# Altium project 60W20V_BuckConverter.PrjPcb
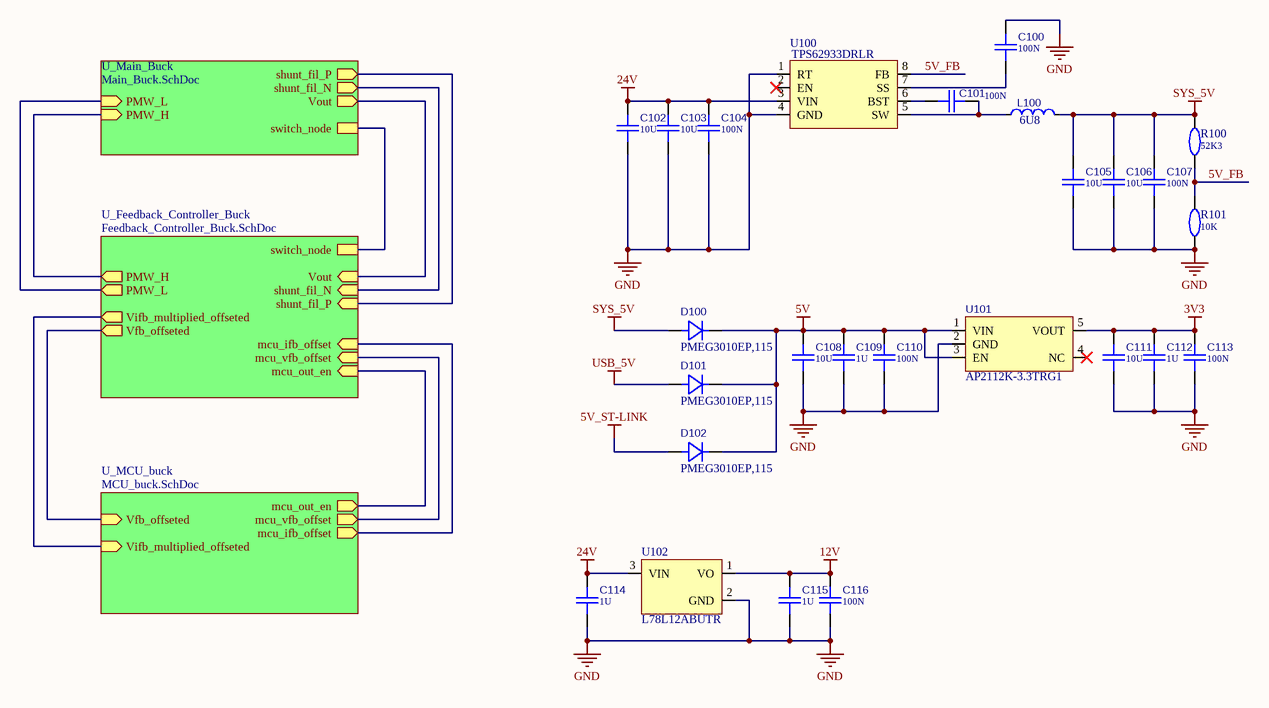
[diagram p0: Top_View.SchDoc]
4 sheets, 155 parts. Net scope: hierarchical (ports join the sheet entries above them; power ports are global).
Board file: Buck_60W20V.pcbdoc
Sheets:
  Top_View.SchDoc
    U_Main_Buck = Main_Buck.SchDoc
    U_Feedback_Controller_Buck = Feedback_Controller_Buck.SchDoc
    U_MCU_buck = MCU_buck.SchDoc

## Sheet Top_View.SchDoc: Buck Converter 20V 60W
size A4; Date: 25 FEB 2024; Author: Arturo S. Bayangos; Revision: V1.0; SheetNumber: 1; SheetTotal: 4

### Parts
C100  value 100N  [CAP_0402]  (hidden comment: CAPACITOR)
C101  value 100N  [CAP_0402]  (hidden comment: CAPACITOR)
C102  value 10U  [CAP_1210]  (hidden comment: CAPACITOR)
C103  value 10U  [CAP_1210]  (hidden comment: CAPACITOR)
C104  value 100N  [CAP_0402]  (hidden comment: CAPACITOR)
C105  value 10U  [CAP_1210]  (hidden comment: CAPACITOR)
C106  value 10U  [CAP_1210]  (hidden comment: CAPACITOR)
C107  value 100N  [CAP_0402]  (hidden comment: CAPACITOR)
C108  value 10U  [CAP_1210]  (hidden comment: CAPACITOR)
C109  value 1U  [CAP_0603]  (hidden comment: CAPACITOR)
C110  value 100N  [CAP_0402]  (hidden comment: CAPACITOR)
C111  value 10U  [CAP_1210]  (hidden comment: CAPACITOR)
C112  value 1U  [CAP_0603]  (hidden comment: CAPACITOR)
C113  value 100N  [CAP_0402]  (hidden comment: CAPACITOR)
C114  value 1U  [CAP_0603]  (hidden comment: CAPACITOR)
C115  value 1U  [CAP_0603]  (hidden comment: CAPACITOR)
C116  value 100N  [CAP_0402]  (hidden comment: CAPACITOR)
D100  value PMEG3010EP,115  [SOD-128]  (hidden comment: DIODE)
D101  value PMEG3010EP,115  [SOD-128]  (hidden comment: DIODE)
D102  value PMEG3010EP,115  [SOD-128]  (hidden comment: DIODE)
L100  value 6U8  [IND_LQH3NPN6R8MMEL]  (hidden comment: INDUCTOR)
R100  value 52K3  [RES_0603]  (hidden comment: RESISTOR)
R101  value 10K  [RES_0603]  (hidden comment: RESISTOR)
U100  value TPS62933DRLR  [SOT-583]  (hidden comment: BUCK-CHIP_8P)
U101  value AP2112K-3.3TRG1  [SOT-23-5]  (hidden comment: LDO_5P)
U102  L78L12ABUTR  [SOT-98-3]

### Sub-sheets
U_Feedback_Controller_Buck = Feedback_Controller_Buck.SchDoc: shunt_fil_P (in), shunt_fil_N (in), PMW_H (out), PMW_L (out), Vout (in), mcu_ifb_offset (in), mcu_vfb_offset (in), mcu_out_en (in), Vifb_multiplied_offseted (out), Vfb_offseted (out), switch_node
U_Main_Buck = Main_Buck.SchDoc: shunt_fil_P (out), shunt_fil_N (out), PMW_H (in), PMW_L (in), Vout (out), switch_node
U_MCU_buck = MCU_buck.SchDoc: mcu_ifb_offset (out), mcu_vfb_offset (out), mcu_out_en (out), Vifb_multiplied_offseted (in), Vfb_offseted (in)

### Nets
3V3: C111.2 C112.2 C113.2 U101.5(VOUT)
5V: C108.2 C109.2 C110.2 D100.1 D101.1 D102.1 U101.1(VIN) U101.3(EN)
5V_ST-LINK: D102.2
12V: C115.2 C116.1 U102.1(VO)
24V: C102.2 C103.2 C104.2 C114.2 U100.3(VIN) U102.3(VIN)
GND: C100.2 C102.1 C103.1 C104.1 C105.1 C106.1 C107.1 C108.1 C109.1 C110.1 C111.1 C112.1 C113.1 C114.1 C115.1 C116.2 R101.1 U100.1(RT) U100.4(GND) U101.2(GND) U102.2(GND)
LOAD_P: sheet U_Main_Buck/Vout, sheet U_Feedback_Controller_Buck/Vout
SYS_5V: C105.2 C106.2 C107.2 D100.2 L100.2 R100.2
USB_5V: D101.2
5V_FB: R100.1 R101.2 U100.8(FB)
mcu_ifb_offset: sheet U_Feedback_Controller_Buck/mcu_ifb_offset, sheet U_MCU_buck/mcu_ifb_offset
mcu_out_en: sheet U_Feedback_Controller_Buck/mcu_out_en, sheet U_MCU_buck/mcu_out_en
mcu_vfb_offset: sheet U_Feedback_Controller_Buck/mcu_vfb_offset, sheet U_MCU_buck/mcu_vfb_offset
PWM_H: sheet U_Main_Buck/PMW_H, sheet U_Feedback_Controller_Buck/PMW_H
PWM_L: sheet U_Main_Buck/PMW_L, sheet U_Feedback_Controller_Buck/PMW_L
shunt_fil_N: sheet U_Main_Buck/shunt_fil_N, sheet U_Feedback_Controller_Buck/shunt_fil_N
shunt_fil_P: sheet U_Main_Buck/shunt_fil_P, sheet U_Feedback_Controller_Buck/shunt_fil_P
switch_node: sheet U_Main_Buck/switch_node, sheet U_Feedback_Controller_Buck/switch_node
Vfb_offseted: sheet U_Feedback_Controller_Buck/Vfb_offseted, sheet U_MCU_buck/Vfb_offseted
Vifb_multiplied_offseted: sheet U_Feedback_Controller_Buck/Vifb_multiplied_offseted, sheet U_MCU_buck/Vifb_multiplied_offseted
NetC100_1: C100.1 U100.7(SS)
NetC101_1: C101.1 U100.6(BST)
NetC101_2: C101.2 L100.1 U100.5(SW)

Not connected (* = marked no-connect by the designer): U100 2(EN)*; U101 4(NC)*

### Notes on the sheet
- Title:
- Revision:
- Variant:
- Size:
- Author:
- A4
- ASB
- Date:
- Sheet:
- of

### Library data of the parts
C100 C101 C104 C107 C110 C113 C116 = UMK105B7104KV-FR: CAP 100N 0402 X7R 50V 10%; Manifacturer: Taiyo Yuden; Part Number: UMK105B7104KV-FR; ComponentLink1Description: Datasheet; ComponentLink1URL: https://datasheet.lcsc.com/lcsc/2211282030_Taiyo-Yuden-UMK105B7104KV-FR_C2167491.pdf; ComponentLink2Description: Characteristics; ComponentLink2URL: Datasheets\Capacitors\UMK105B7104KV-FR_TaiyoYuden.pdf; Package: 0402
C102 C103 C105 C106 C108 C111 = UMK325AB7106KM-T: CAP 10U 1210 X7R 50V 10%; Manifacturer: Taiyo Yuden; Part Number: UMK325AB7106KM-T; ComponentLink1Description: Datasheet; ComponentLink1URL: https://datasheet.lcsc.com/lcsc/2211282230_Taiyo-Yuden-UMK325AB7106KM-T_C386167.pdf; ComponentLink2Description: Characteristics; ComponentLink2URL: Datasheets\Capacitors\UMK325AB7106KM-T_TaiyoYuden_Char.pdf; Package: 1210
C109 C112 C114 C115 = TMK107AB7105KAHT: CAP 1U 0603 X7R 25V 10%; Manifacturer: Taiyo Yuden; Part Number: TMK107AB7105KAHT; ComponentLink1Description: Datasheet; ComponentLink1URL: https://datasheet.lcsc.com/lcsc/1912111437_Taiyo-Yuden-TMK107AB7105KAHT_C386079.pdf; ComponentLink2Description: Characteristics; ComponentLink2URL: Datasheets\Capacitors\TMK107AB7105KAHT_TaiyoYuden.pdf; Package: 0603
D100-D102 = PMEG3010EP,115: DIODE PMEG3010EP,115 SOD-128  Schottky 30V 1A; Forward voltage: 0.36V @ 1A; Manifacturer: Nexperia; Part Number: PMEG3010EP,115; Package: SOD-128; Type: Schottky; Current: 1A; Voltage: 30V; Operating temperature: 150 ℃; ComponentLink1Description: Datasheet; ComponentLink1URL: https://datasheet.lcsc.com/lcsc/2006101642_Nexperia-PMEG3010EP-115_C552865.pdf
L100 = LQH3NPN6R8MMEL: IND 6U8 SMD_W3mm_L3mm 0.9A 1.04A; Manifacturer: Murata Electronics; ComponentLink1Description: Datasheet; ComponentLink2Description: Characteristics; Part Number: LQH3NPN6R8MMEL; Irated: 0.9A; Isat: 1.04A; Package: SMD_W3mm_L3mm
R100 = ERA3AEB5232V: RES 52K3 0603 0.1% 0.1W 75V; Manifacturer: PANASONIC; Part Number: ERA3AEB5232V; ComponentLink1Description: Datasheet; ComponentLink1URL: https://datasheet.lcsc.com/lcsc/2005181233_PANASONIC-ERA3AEB5232V_C491140.pdf; ComponentLink2Description: Characteristics; Package: 0603
R101 = ARG03BTC1002: RES 10K 0603 0.1W 0.1% 75V; Manifacturer: Viking Tech; Part Number: ARG03BTC1002; ComponentLink1Description: Datasheet; ComponentLink1URL: Datasheets\Resistors\ARG03BTC1002_VikingTech.pdf; ComponentLink2Description: Characteristics; Package: 0603
U100 = TPS62933DRLR: IC TPS62933DRLR SOT-583 BUCK-CHIP; Supply Voltage: 3.8V-30V; Tj: 150 ℃; Manifacturer: Texas Instruments; Part Number: TPS62933DRLR; Package: SOT-583; Type: BUCK-CHIP; ComponentLink1Description: Datasheet; ComponentLink1URL: https://www.ti.com/lit/ds/symlink/tps62933p.pdf?ts=1658586703977&ref_url=https%253A%252F%252Fwww.ti.com%252Fproduct%252FTPS62933P%253Fjktype%253Dhomepageproduct; ComponentLink2Description: Characteristics
U101 = AP2112K-3.3TRG1: LDO AP2112K-3.3TRG1 SOT-25-5 3.3V 600mA; Dropout Voltage: 1.3V @ 600mA; Supply Voltage: 6.5V; Tj: 150 ℃; Manifacturer: Diodes Incorporated; Part Number: AP2112K-3.3TRG1; Package: SOT-25; Features: Current limiting, Thermal shutdown; Type: LDO; ComponentLink1Description: Datasheet; ComponentLink1URL: https://datasheet.lcsc.com/lcsc/2304140030_Diodes-Incorporated-AP2112K-3-3TRG1_C51118.pdf
U102 = L78L12ABUTR: LDO L78L12ABUTR SOT-89-3 12V 100mA; Dropout Voltage: 1.7V (typ); Supply Voltage: 35V; Tj: 125 ℃; Manifacturer: STMicroelectronics; Value: L78L12ABUTR; Part Number: L78L12ABUTR; Package: SOT-98-3; Features: Thermal overload, short circuit protection.; Type: LDO; ComponentLink1Description: Datasheet; ComponentLink1URL: https://datasheet.lcsc.com/lcsc/2011051905_STMicroelectronics-L78L12ABUTR_C915681.pdf

## Sheet Main_Buck.SchDoc: Buck Converter 60W 20V
size A4; Date: 25 FEB 2024; Author: Arturo S. Bayangos; Revision: V1.0; SheetNumber: 2; SheetTotal: 4
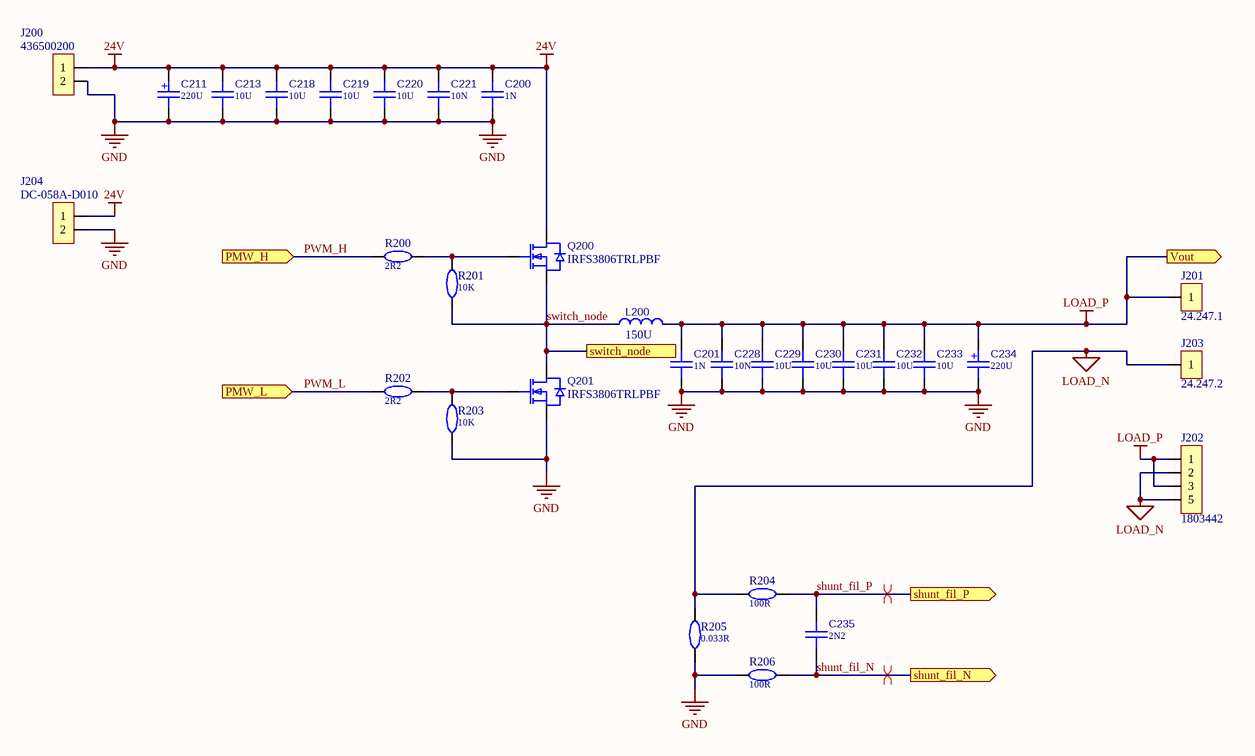
[diagram p1: Main_Buck.SchDoc]

### Parts
C200  value 1N  [CAP_0402]  (hidden comment: CAPACITOR)
C201  value 1N  [CAP_0402]  (hidden comment: CAPACITOR)
C211  value 220U  [CAP_SMD_UUD1H221MNL1GS]  (hidden comment: CAPACITOR_POLARIZED)
C213  value 10U  [CAP_1210]  (hidden comment: CAPACITOR)
C218  value 10U  [CAP_1210]  (hidden comment: CAPACITOR)
C219  value 10U  [CAP_1210]  (hidden comment: CAPACITOR)
C220  value 10U  [CAP_1210]  (hidden comment: CAPACITOR)
C221  value 10N  [CAP_0402]  (hidden comment: CAPACITOR)
C228  value 10N  [CAP_0402]  (hidden comment: CAPACITOR)
C229  value 10U  [CAP_1210]  (hidden comment: CAPACITOR)
C230  value 10U  [CAP_1210]  (hidden comment: CAPACITOR)
C231  value 10U  [CAP_1210]  (hidden comment: CAPACITOR)
C232  value 10U  [CAP_1210]  (hidden comment: CAPACITOR)
C233  value 10U  [CAP_1210]  (hidden comment: CAPACITOR)
C234  value 220U  [CAP_SMD_UUD1H221MNL1GS]  (hidden comment: CAPACITOR_POLARIZED)
C235  value 2N2  [CAP_0603]  (hidden comment: CAPACITOR)
J200  value 436500200  [CON_436500200]  (hidden comment: JACK_2P)
J201  value 24.247.1  [BANANA_JACK_RED_24.247.1]  (hidden comment: JACK_1P)
J202  value 1803442  [CON_1803442]  (hidden comment: JACK_4P)
J203  value 24.247.2  [BANANA_JACK_BLACK_24.247.2]  (hidden comment: JACK_1P)
J204  value DC-058A-D010  [CON_DC-058A-D010]  (hidden comment: JACK_2P)
L200  value 150U  [IND_74437429203151]  (hidden comment: INDUCTOR)
Q200  value IRFS3806TRLPBF  [D2PAK]  (hidden comment: MOSFET_NCHANNEL)
Q201  value IRFS3806TRLPBF  [D2PAK]  (hidden comment: MOSFET_NCHANNEL)
R200  value 2R2  [RES_0603]  (hidden comment: RESISTOR)
R201  value 10K  [RES_0603]  (hidden comment: RESISTOR)
R202  value 2R2  [RES_0603]  (hidden comment: RESISTOR)
R203  value 10K  [RES_0603]  (hidden comment: RESISTOR)
R204  value 100R  [RES_0603]  (hidden comment: RESISTOR)
R205  value 0.033R  [RES_1210]  (hidden comment: RESISTOR)
R206  value 100R  [RES_0603]  (hidden comment: RESISTOR)

### Ports
PMW_H (in), PMW_L (in), shunt_fil_N (out), shunt_fil_P (out), switch_node, Vout (out)

### Nets
24V: C200.2 C211.1 C213.1 C218.1 C219.1 C220.1 C221.2 J200.1 J204.1 Q200.4(D)
GND: C200.1 C201.2 C211.2 C213.2 C218.2 C219.2 C220.2 C221.1 C228.1 C229.2 C230.2 C231.2 C232.2 C233.2 C234.2 J200.2 J204.2 Q201.3(S) R203.1 R205.1 R206.1
LOAD_N: J202.2 J202.4(5) J203.1 R204.1 R205.2
LOAD_P: C201.1 C228.2 C229.1 C230.1 C231.1 C232.1 C233.1 C234.1 J201.1 J202.1 J202.3 L200.2 ; port Vout
PWM_H: R200.1 ; port PMW_H
PWM_L: R202.1 ; port PMW_L
shunt_fil_N: C235.1 R206.2 ; port shunt_fil_N
shunt_fil_P: C235.2 R204.2 ; port shunt_fil_P
switch_node: L200.1 Q200.3(S) Q201.4(D) R201.1 ; port switch_node
NetQ200_1: Q200.1(G) R200.2 R201.2
NetQ201_1: Q201.1(G) R202.2 R203.2

### Layout directives
differential pair: shunt_fil_N, shunt_fil_P

### Notes on the sheet
- Title:
- Revision:
- Variant:
- Size:
- Author:
- A4
- ASB
- Date:
- Sheet:
- of
- (in symbol UUD1H221MNL1GS) +

### Library data of the parts
C200 C201 = UMF105B7102KVHF: CAP 1N 0402 X7R 50V 10%; Manifacturer: Taiyo Yuden; Part Number: UMF105B7102KVHF; ComponentLink1Description: Datasheet; ComponentLink1URL: https://datasheet.lcsc.com/lcsc/1912111437_Taiyo-Yuden-UMF105B7102KVHF_C386104.pdf; ComponentLink2Description: Characteristics; ComponentLink2URL: Datasheets\Capacitors\UMF105B7102KVHF_TaiyoYuden.pdf; Package: 0402
C211 C234 = UUD1H221MNL1GS: CAP 220U SMD_D10mm_L10mm ELEC 50V 20%; Manifacturer: Nichicon; Part Number: UUD1H221MNL1GS; ComponentLink1Description: Datasheet; ComponentLink2Description: Characteristics; Package: SMD_D10mm_L10mm
C213 C218-C220 C229-C233 = UMK325AB7106KM-T: as C102 on sheet Top_View; Part Number: UMK325AB7106KM-T; ComponentLink1Description: Datasheet; ComponentLink1URL: https://datasheet.lcsc.com/lcsc/2211282230_Taiyo-Yuden-UMK325AB7106KM-T_C386167.pdf; ComponentLink2Description: Characteristics; ComponentLink2URL: Datasheets\Capacitors\UMK325AB7106KM-T_TaiyoYuden_Char.pdf; Package: 1210
C221 C228 = UMF105B7103KVHF: CAP 10N 0402 X7R 50V 10%; Manifacturer: Taiyo Yuden; Part Number: UMF105B7103KVHF; ComponentLink1Description: Datasheet; ComponentLink1URL: https://datasheet.lcsc.com/lcsc/1912111437_Taiyo-Yuden-UMF105B7103KVHF_C386105.pdf; ComponentLink2Description: Characteristics; ComponentLink2URL: Datasheets\Capacitors\UMF105B7103KVHF_TaiyoYuden.pdf; Package: 0402
C235 = C1608C0G2E222JT000N: CAP 2N2 0603 NPO 250V 5%; Manifacturer: TDK; Part Number: C1608C0G2E222JT000N; ComponentLink1Description: Datasheet; ComponentLink1URL: https://datasheet.lcsc.com/lcsc/2304140030_TDK-C1608C0G2E222JT000N_C694281.pdf; ComponentLink2Description: Characteristics; Package: 0603
J200 = 436500200: RECEP 436500200 TH 3mm HORIZ; Pitch: NA; Voltage: 600V; Current: 8.5A; Structure: RERCEP 2WIRE HORIZ; Manifacturer: MOLEX; ComponentLink1Description: Datasheet; ComponentLink1URL: https://datasheet.lcsc.com/lcsc/2305301754_MOLEX-436500200_C192562.pdf; Part Number: 436500200; Package: TH; Supported protocol: NA
J201 = 24.247.1: JACK  24.247.1 TH 4mm  VERT RED; Pitch: NA; Voltage: 60V; Current: 32A; Structure: VERT RED BANANA JACK; Manifacturer: Changzhou Amass Elec; ComponentLink1Description: Datasheet; ComponentLink1URL: https://www.lcsc.com/product-detail/Banana-Connectors-Alligator-Clips_Changzhou-Amass-Elec-24-247-2_C106272.html; Part Number: 24.247.1; Package: TH; Supported protocol: NA
J202 = 1803442: RECEP 1803442 TH 3.81mm HORIZ; Voltage: 160V; Current: 8A; Structure: RECEP 4WIRE VERT; Supported protocol: NA; Manifacturer: Phoenix Contact; ComponentLink1Description: Datasheet; ComponentLink1URL: https://datasheet.lcsc.com/lcsc/2001071235_Phoenix-Contact-1803442_C480518.pdf; Part Number: 1803442; Package: TH; Pitch: 3.81mm
J203 = 24.247.2: JACK  24.247.2 TH 4mm  VERT BLACK; Pitch: NA; Voltage: 60V; Current: 32A; Structure: VERT BLACK BANANA JACK; Manifacturer: Changzhou Amass Elec; ComponentLink1Description: Datasheet; ComponentLink1URL: https://www.lcsc.com/product-detail/Banana-Connectors-Alligator-Clips_Changzhou-Amass-Elec-24-247-2_C106272.html; Part Number: 24.247.2; Package: TH; Supported protocol: NA
J204 = DC-058A-D010: JACK / DC-058A-D010 TH  HORIZ; Pitch: NA; Voltage: 12V; Current: 5A; Structure: HORZ 2WIRE Jack; Manifacturer: G-Switch; ComponentLink1Description: Datasheet; ComponentLink1URL: https://datasheet.lcsc.com/lcsc/2102241737_G-Switch-DC-058A-D010_C2686970.pdf; Part Number: DC-058A-D010; Package: TH; Supported protocol: NA
L200 = 74437429203151: IND 150U SMD_W25mm_L28mm 8.4A 7.8A; Manifacturer: Wurth Electronik; Part Number: 74437429203151; Irated: 8.4A; Isat: 7.8A; Package: SMD_W25mm_L28mm
Q200 Q201 = IRFS3806TRLPBF: NFET IRFS3806TRLPBF D2PAK 60V 43A 15.8mΩ; Rdson(max): 15.8mR; Tjmax: 175 °C; Manifacturer: Infineon Technologies; ComponentLink1Description: Datasheet; ComponentLink1URL: https://datasheet.lcsc.com/lcsc/2005292345_Infineon-Technologies-IRFS3806TRLPBF_C538013.pdf; ComponentLink2Description: Characteristics; Part Number: IRFS3806TRLPBF; Package: D2PAK; Voltage: 60V; Current (Tcase = 25°C): 43A
R200 R202 = 0603WAJ022JT5E: RES 2R2 0603 0.1W 5% 75V; Manifacturer: UNI-ROYAL; Part Number: 0603WAJ022JT5E; ComponentLink1Description: Datasheet; ComponentLink1URL: Datasheets\Resistors\0603WAJ022JT5E_UniRoyal.pdf; ComponentLink2Description: Characteristics; Package: 0603
R201 R203 = ARG03BTC1002: as R101 on sheet Top_View; Part Number: ARG03BTC1002; ComponentLink1Description: Datasheet; ComponentLink1URL: Datasheets\Resistors\ARG03BTC1002_VikingTech.pdf; ComponentLink2Description: Characteristics; Package: 0603
R204 R206 = RT0603CRE07100RL: RES 100R 00603 0.1W 0.25% 75V; Manifacturer: YAGEO; Part Number: RT0603CRE07100RL; ComponentLink1Description: Datasheet; ComponentLink1URL: Datasheets\Resistors\RT0603CRE07100RL_Yageo.pdf; ComponentLink2Description: Characteristics; Package: 0603
R205 = RTT12R033FTP: RES 0.033R 1210 1% 0.5W 200V; Manifacturer: RALEC; Part Number: RTT12R033FTP; ComponentLink1Description: Datasheet; ComponentLink1URL: Datasheets\Resistors\RTT12R033FTP_Ralec.pdf; ComponentLink2Description: Characteristics; Package: 1210

## Sheet Feedback_Controller_Buck.SchDoc: Buck Converter 20V 60W
size A4; Date: 25 FEB 2024; Author: Arturo S. Bayangos; Revision: V.10; SheetNumber: 3; SheetTotal: 4
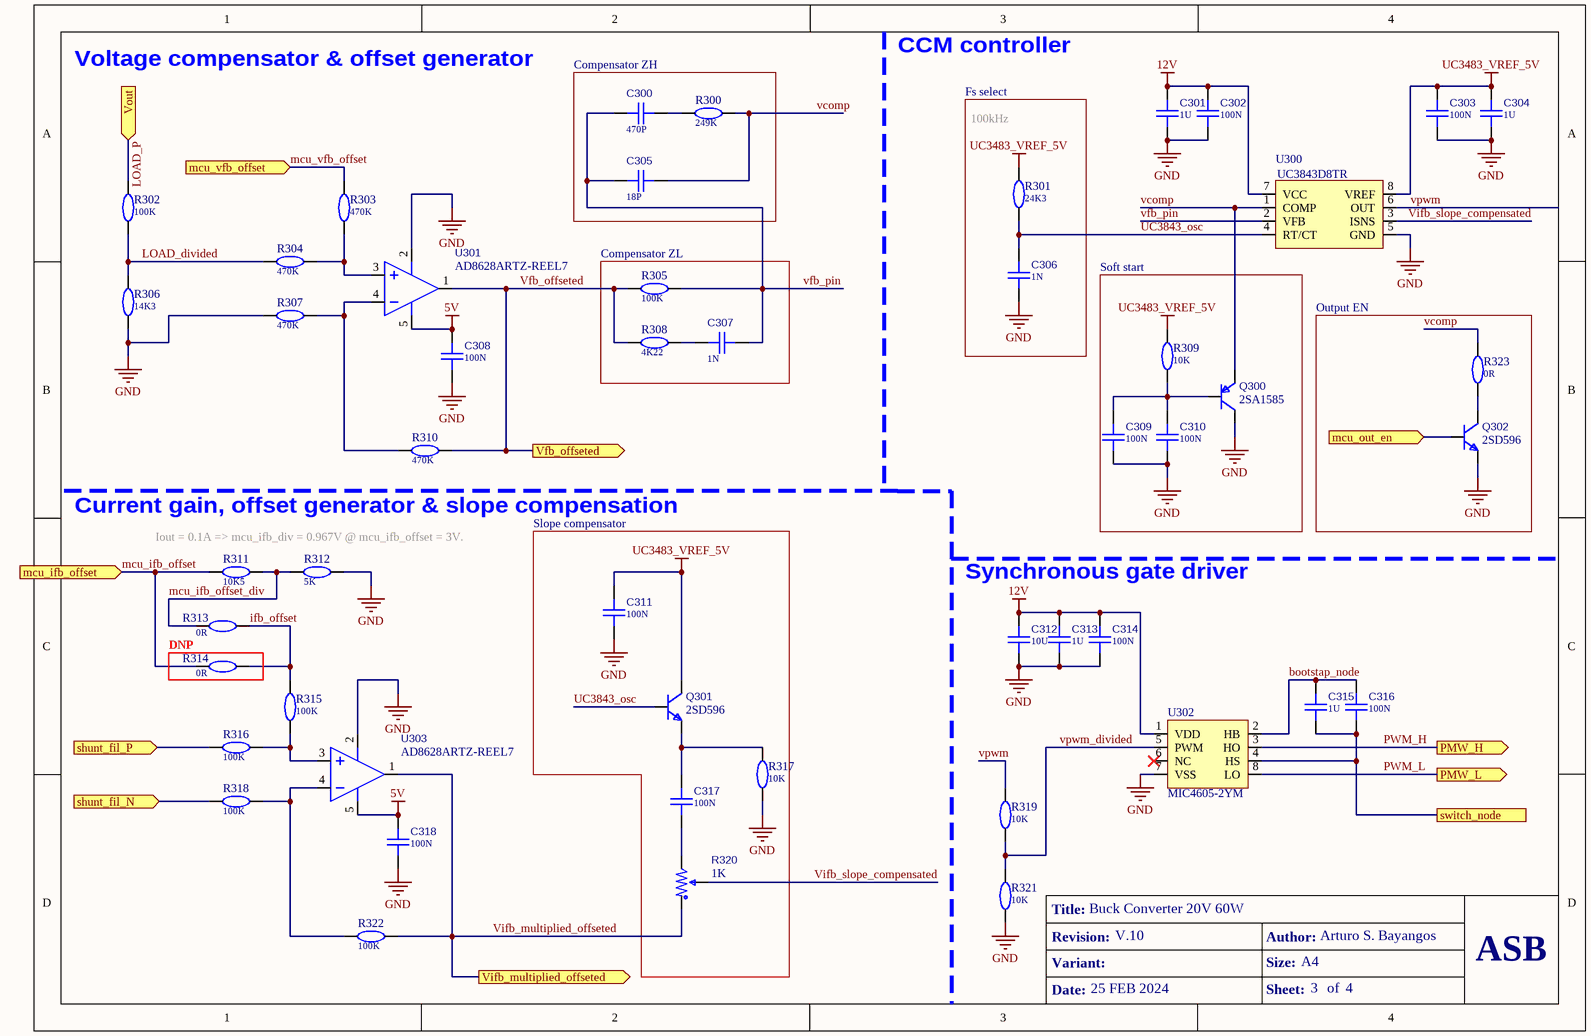
[diagram p2: Feedback_Controller_Buck.SchDoc]

### Parts
C300  value 470P  [CAP_0603]  (hidden comment: CAPACITOR)
C301  value 1U  [CAP_0603]  (hidden comment: CAPACITOR)
C302  value 100N  [CAP_0402]  (hidden comment: CAPACITOR)
C303  value 100N  [CAP_0402]  (hidden comment: CAPACITOR)
C304  value 1U  [CAP_0603]  (hidden comment: CAPACITOR)
C305  value 18P  [CAP_0603]  (hidden comment: CAPACITOR)
C306  value 1N  [CAP_0603]  (hidden comment: CAPACITOR)
C307  value 1N  [CAP_0603]  (hidden comment: CAPACITOR)
C308  value 100N  [CAP_0402]  (hidden comment: CAPACITOR)
C309  value 100N  [CAP_0402]  (hidden comment: CAPACITOR)
C310  value 100N  [CAP_0402]  (hidden comment: CAPACITOR)
C311  value 100N  [CAP_0402]  (hidden comment: CAPACITOR)
C312  value 10U  [CAP_1210]  (hidden comment: CAPACITOR)
C313  value 1U  [CAP_0603]  (hidden comment: CAPACITOR)
C314  value 100N  [CAP_0402]  (hidden comment: CAPACITOR)
C315  value 1U  [CAP_0603]  (hidden comment: CAPACITOR)
C316  value 100N  [CAP_0402]  (hidden comment: CAPACITOR)
C317  value 100N  [CAP_0402]  (hidden comment: CAPACITOR)
C318  value 100N  [CAP_0402]  (hidden comment: CAPACITOR)
Q300  value 2SA1585  [SOT-23]  (hidden comment: BJT_PNP)
Q301  value 2SD596  [SOT-23]  (hidden comment: BJT_NPN)
Q302  value 2SD596  [SOT-23]  (hidden comment: BJT_NPN)
R300  value 249K  [RES_0603]  (hidden comment: RESISTOR)
R301  value 24K3  [RES_0603]  (hidden comment: RESISTOR)
R302  value 100K  [RES_0603]  (hidden comment: RESISTOR)
R303  value 470K  [RES_0603]  (hidden comment: RESISTOR)
R304  value 470K  [RES_0603]  (hidden comment: RESISTOR)
R305  value 100K  [RES_0603]  (hidden comment: RESISTOR)
R306  value 14K3  [RES_0603]  (hidden comment: RESISTOR)
R307  value 470K  [RES_0603]  (hidden comment: RESISTOR)
R308  value 4K22  [RES_0603]  (hidden comment: RESISTOR)
R309  value 10K  [RES_0603]  (hidden comment: RESISTOR)
R310  value 470K  [RES_0603]  (hidden comment: RESISTOR)
R311  value 10K5  [RES_0402]  (hidden comment: RESISTOR)
R312  value 5K  [RES_0402]  (hidden comment: RESISTOR)
R313  value 0R  [RES_0402]  (hidden comment: RESISTOR)
R314  value 0R  [RES_0402]  (hidden comment: RESISTOR)
R315  value 100K  [RES_0603]  (hidden comment: RESISTOR)
R316  value 100K  [RES_0603]  (hidden comment: RESISTOR)
R317  value 10K  [RES_0603]  (hidden comment: RESISTOR)
R318  value 100K  [RES_0603]  (hidden comment: RESISTOR)
R319  value 10K  [RES_0603]  (hidden comment: RESISTOR)
R320  value 1K  [RES_GF063P1-B102]  (hidden comment: RESISTOR_POT)
R321  value 10K  [RES_0603]  (hidden comment: RESISTOR)
R322  value 100K  [RES_0603]  (hidden comment: RESISTOR)
R323  value 0R  [RES_0402]  (hidden comment: RESISTOR)
U300  value UC3843D8TR  [SOIC-8]  (hidden comment: PWM-CONTROLLER_8P)
U301  value AD8628ARTZ-REEL7  [SOT-23-5]  (hidden comment: OPAMP_1)
U302  value MIC4605-2YM  [SOIC-8]  (hidden comment: GATEDRIVE_8P_SINGLE-PWM)
U303  value AD8628ARTZ-REEL7  [SOT-23-5]  (hidden comment: OPAMP_1)

### Blocks framed on the sheet
Compensator ZH: C300 C305 R300
Compensator ZL: C307 R305 R308
Soft start: C309 C310 Q300 R309
Output EN: Q302 R323
Slope compensator: C311 C317 Q301 R317 R320

### Ports
mcu_ifb_offset (in), mcu_out_en (in), mcu_vfb_offset (in), PMW_H (out), PMW_L (out), shunt_fil_N (in), shunt_fil_P (in), switch_node, Vfb_offseted (out), Vifb_multiplied_offseted (out), Vout (in)

### Nets
5V: C308.2 C318.2 U301.5(+V) U303.5(+V)
12V: C301.2 C302.2 C312.2 C313.1 C314.2 U300.7(VCC) U302.1(VDD)
GND: C301.1 C302.1 C303.1 C304.1 C306.2 C308.1 C309.1 C310.1 C311.1 C312.1 C313.2 C314.1 C318.1 Q300.3(C) Q302.2(E) R306.1 R307.1 R312.2 R317.1 R321.1 U300.5(GND) U301.2(-V) U302.7(VSS) U303.2(-V)
LOAD_P: R302.2 ; port Vout
UC3483_VREF_5V: C303.2 C304.2 C311.2 Q301.3(C) R301.2 R309.2 U300.8(VREF)
bootstap_node: C315.2 C316.1 U302.2(HB)
ifb_offset: R313.2 R314.2 R315.2
LOAD_divided: R302.1 R304.1 R306.2
mcu_ifb_offset: R311.1 R314.1 ; port mcu_ifb_offset
mcu_ifb_offset_div: R311.2 R312.1 R313.1
mcu_out_en: Q302.1(B) ; port mcu_out_en
mcu_vfb_offset: R303.2 ; port mcu_vfb_offset
PWM_H: U302.3(HO) ; port PMW_H
PWM_L: U302.8(LO) ; port PMW_L
shunt_fil_N: R318.1 ; port shunt_fil_N
shunt_fil_P: R316.1 ; port shunt_fil_P
switch_node: C315.1 C316.2 U302.4(HS) ; port switch_node
UC3843_osc: C306.1 Q301.1(B) R301.1 U300.4(RT/CT)
vcomp: C305.2 Q300.2(E) R300.2 R323.2 U300.1(COMP)
Vfb_offseted: R305.1 R308.1 R310.2 U301.1(OUT) ; port Vfb_offseted
vfb_pin: C300.1 C305.1 C307.2 R305.2 U300.2(VFB)
Vifb_multiplied_offseted: R320.1 R322.2 U303.1(OUT) ; port Vifb_multiplied_offseted
Vifb_slope_compensated: R320.2 U300.3(ISNS)
vpwm: R319.2 U300.6(OUT)
vpwm_divided: R319.1 R321.2 U302.5(PWM)
NetC300_2: C300.2 R300.1
NetC307_1: C307.1 R308.2
NetC309_2: C309.2 C310.2 Q300.1(B) R309.1
NetC317_1: C317.1 R320.3
NetC317_2: C317.2 Q301.2(E) R317.2
NetQ302_3: Q302.3(C) R323.1
NetR303_1: R303.1 R304.2 U301.3(+IN)
NetR307_2: R307.2 R310.1 U301.4(-IN)
NetR315_1: R315.1 R316.2 U303.3(+IN)
NetR318_2: R318.2 R322.1 U303.4(-IN)

Not connected (* = marked no-connect by the designer): U302 6(NC)*

### Notes on the sheet
- Voltage compensator & offset generator
- CCM controller
- Fs select
- 100kHz
- Current gain, offset generator & slope compensation
- Iout = 0.1A => mcu_ifb_div = 0.967V @ mcu_ifb_offset = 3V.
- Synchronous gate driver
- DNP
- Title:
- Revision:
- Variant:
- Size:
- Author:
- A4
- ASB
- Date:
- Sheet:
- of

### Library data of the parts
C300 = CC0603GRNPO9BN471: CAP 470P 0603 NPO 50V 2%; Manifacturer: YAGEO; Part Number: CC0603GRNPO9BN471; ComponentLink1Description: Datasheet; ComponentLink1URL: https://datasheet.lcsc.com/lcsc/2304140030_YAGEO-CC0603GRNPO9BN471_C327194.pdf; ComponentLink2Description: Characteristics; Package: 0603
C301 C304 C313 C315 = TMK107AB7105KAHT: as C109 on sheet Top_View; Part Number: TMK107AB7105KAHT; ComponentLink1Description: Datasheet; ComponentLink1URL: https://datasheet.lcsc.com/lcsc/1912111437_Taiyo-Yuden-TMK107AB7105KAHT_C386079.pdf; ComponentLink2Description: Characteristics; ComponentLink2URL: Datasheets\Capacitors\TMK107AB7105KAHT_TaiyoYuden.pdf; Package: 0603
C302 C303 C308-C311 C314 C316-C318 = UMK105B7104KV-FR: as C100 on sheet Top_View; Part Number: UMK105B7104KV-FR; ComponentLink1Description: Datasheet; ComponentLink1URL: https://datasheet.lcsc.com/lcsc/2211282030_Taiyo-Yuden-UMK105B7104KV-FR_C2167491.pdf; ComponentLink2Description: Characteristics; ComponentLink2URL: Datasheets\Capacitors\UMK105B7104KV-FR_TaiyoYuden.pdf; Package: 0402
C305 = CC0603JRNPO9BN180: CAP 18P 0603 NPO 50V 5%; Manifacturer: YAGEO; Part Number: CC0603JRNPO9BN180; ComponentLink1Description: Datasheet; ComponentLink1URL: https://datasheet.lcsc.com/lcsc/2304140030_YAGEO-CC0603JRNPO9BN180_C107040.pdf; ComponentLink2Description: Characteristics; Package: 0603
C306 C307 = CC0603GRNPO8BN102: CAP 1N 0603 NPO 25V 2%; Manifacturer: YAGEO; Part Number: CC0603GRNPO8BN102; ComponentLink1Description: Datasheet; ComponentLink1URL: https://datasheet.lcsc.com/lcsc/2005181835_YAGEO-CC0603GRNPO8BN102_C519480.pdf; ComponentLink2Description: Characteristics; Package: 0603
C312 = UMK325AB7106KM-T: as C102 on sheet Top_View; Part Number: UMK325AB7106KM-T; ComponentLink1Description: Datasheet; ComponentLink1URL: https://datasheet.lcsc.com/lcsc/2211282230_Taiyo-Yuden-UMK325AB7106KM-T_C386167.pdf; ComponentLink2Description: Characteristics; ComponentLink2URL: Datasheets\Capacitors\UMK325AB7106KM-T_TaiyoYuden_Char.pdf; Package: 1210
Q300 = 2SA1585: PNP 2SA1585 SOT-23 20V 0.35W; VEBO: 6V; Tjmax: 150 °C; Manifacturer: Jiangsu Changjing Electronics Technology Co., Ltd.; Part Number: 2SA1585; Package: SOT-23; VCEO: 20V; Power: 0.35W; ComponentLink1Description: Datasheet; ComponentLink1URL: https://datasheet.lcsc.com/lcsc/1810010514_Jiangsu-Changjing-Electronics-Technology-Co---Ltd--2SA1585_C92477.pdf; ComponentLink2Description: Characteristics
Q301 Q302 = 2SD596: NPN 2SD596 SOT-23 25V 0.2W; VEBO: 5V; Tjmax: 150 °C; Manifacturer: YONGYUTAI; ComponentLink1Description: Datasheet; ComponentLink1URL: https://datasheet.lcsc.com/lcsc/2109011130_YONGYUTAI-2SD596_C2891824.pdf; Part Number: 2SD596; Package: SOT-23; VCEO: 25V; Power: 0.2W
R300 = FRC0603F2493TS: RES 249K 0603 1% 0.1W 75V; Manifacturer: FOJAN; Part Number: FRC0603F2493TS; ComponentLink1Description: Datasheet; ComponentLink1URL: https://datasheet.lcsc.com/lcsc/2308241103_FOJAN-FRC0603F2493TS_C2933177.pdf; ComponentLink2Description: Characteristics; Package: 0603
R301 = WF06H2432BTL: RES 24K3 0603 0.1% 0.1W 50V; Manifacturer: Walsin Tech Corp; Part Number: WF06H2432BTL; ComponentLink1Description: Datasheet; ComponentLink1URL: https://datasheet.lcsc.com/lcsc/2207151730_Walsin-Tech-Corp-WF06H2432BTL_C4354966.pdf; ComponentLink2Description: Characteristics; Package: 0603
R302 R305 R315 R316 R318 R322 = RC0603FR-07100KL: RES 100K 0603 1% 0.1W 75V; Manifacturer: YAGEO; Part Number: RC0603FR-07100KL; ComponentLink1Description: Datasheet; ComponentLink1URL: https://datasheet.lcsc.com/lcsc/1809281124_YAGEO-RC0603FR-07100KL_C14675.pdf; ComponentLink2Description: Characteristics; Package: 0603
R303 R304 R307 R310 = 0603WAF4703T5E: RES 470K 0603 1% 0.1W 75V; Manifacturer: UNI-ROYAL; Part Number: 0603WAF4703T5E; ComponentLink1Description: Datasheet; ComponentLink1URL: https://datasheet.lcsc.com/lcsc/2206010116_UNI-ROYAL-Uniroyal-Elec-0603WAF4703T5E_C23178.pdf; ComponentLink2Description: Characteristics; Package: 0603
R306 = RT0603BRE0714K3L: RES 14K3 0603 1% 0.1W 75V; Manifacturer: YAGEO; Part Number: RT0603BRE0714K3L; ComponentLink1Description: Datasheet; ComponentLink1URL: https://datasheet.lcsc.com/lcsc/2009282136_YAGEO-RT0603BRE0714K3L_C705810.pdf; ComponentLink2Description: Characteristics; Package: 0603
R308 = CRCW06034K22FKEA: RES 4K22 0603 1% 0.1W 75V; Manifacturer: Vishay Intertech; Part Number: CRCW06034K22FKEA; ComponentLink1Description: Datasheet; ComponentLink1URL: https://datasheet.lcsc.com/lcsc/2304140030_Vishay-Intertech-CRCW06034K22FKEA_C843958.pdf; ComponentLink2Description: Characteristics; Package: 0603
R309 R317 R319 R321 = ARG03BTC1002: as R101 on sheet Top_View; Part Number: ARG03BTC1002; ComponentLink1Description: Datasheet; ComponentLink1URL: Datasheets\Resistors\ARG03BTC1002_VikingTech.pdf; ComponentLink2Description: Characteristics; Package: 0603
R311 = TC0250B1052TCC: RES 10K5 0402 0.1% 0.625W 25V; Manifacturer: UNI-ROYAL(Uniroyal Elec); Part Number: TC0250B1052TCC; ComponentLink1Description: Datasheet; ComponentLink1URL: https://datasheet.lcsc.com/lcsc/2304140030_UNI-ROYAL-Uniroyal-Elec-TC0250B1052TCC_C517521.pdf; Package: 0402
R312 = AR02BTC5001: RES 5K 0402 0.1% 0.63W; Manifacturer: Viking Tech; Part Number: AR02BTC5001; ComponentLink1Description: Datasheet; ComponentLink1URL: https://datasheet.lcsc.com/lcsc/2311271515_Viking-Tech-AR02BTC5001_C5948099.pdf; Package: 0402
R313 R314 R323 = 0402WGF0000TCE: RES 0R 0402 1% 0.625W; Manifacturer: UNI-ROYAL(Uniroyal Elec); Part Number: 0402WGF0000TCE; ComponentLink1Description: Datasheet; ComponentLink1URL: https://datasheet.lcsc.com/lcsc/2206010216_UNI-ROYAL-Uniroyal-Elec-0402WGF0000TCE_C17168.pdf; Package: 0402
R320 = GF063P1-B102: RES POT 1K TH 20%; Manifacturer: Tokyo Cosmos Elec; ComponentLink1Description: Datasheet; ComponentLink1URL: https://datasheet.lcsc.com/lcsc/2304140030_Tokyo-Cosmos-Elec-GF063P1-B102_C128078.pdf; ComponentLink2Description: Characteristics; Part Number: GF063P1-B102; Package: TH
U300 = UC3843D8TR: IC UC3843D8TR SOIC-8 PWM-CONTROLLER; Supply Voltage: 30V; Tj: 150 ℃; Manifacturer: Texas Instruments; Part Number: UC3843D8TR; Package: SOIC-8; Type: PWM-CONTROLLER; ComponentLink1Description: Datasheet; ComponentLink1URL: https://www.ti.com/lit/ds/symlink/uc3842.pdf?HQS=dis-dk-null-digikeymode-dsf-pf-null-wwe&ts=1707097391176; ComponentLink2Description: Characteristics
U301 U303 = AD8628ARTZ-REEL7: OPAMP AD8628ARTZ-REEL7 SOT-23-5 2.5MHz; Voltage - Input Offset(Vos): 1uV; Current - Input Bias(Ib): 30pA; Number of Circuits: 1; Supply Voltage: 6V; Manifacturer: Analog Devices; ComponentLink1Description: Datasheet; ComponentLink1URL: https://datasheet.lcsc.com/lcsc/1811091710_Analog-Devices-AD8628ARTZ-REEL7_C29309.pdf; ComponentLink2Description: Characteristics; Part Number: AD8628ARTZ-REEL7; Package: SOT-23-5; Gain Bandwidth Product(GBP): 2.5MHz; Operating Temperature: -40℃~+125℃
U302 = MIC4605-2YM: GATEDRVR MIC4605-2YM SOIC-8 HALF-BRIDGE  5.5V-16V; Tj: 125℃; Low-Level Input Voltage (min): 0.8V; High-Level Input Voltage (max): 2.2V; Propagation delay (max): 75ns; Manifacturer: Microchip Tech; Part Number: MIC4605-2YM; Package: SOIC-8; Type: HALF-BRIDGE; Supply Voltage: 5.5V-16V; ComponentLink1Description: Datasheet; ComponentLink1URL: https://datasheet.lcsc.com/lcsc/2309071225_Microchip-Tech-MIC4605-2YM_C637550.pdf; ComponentLink2Description: Characteristics

## Sheet MCU_buck.SchDoc: Buck Converter 20V 60W
size A4; Date: 25 FEB 2024; Author: Arturo S. Bayangos; Revision: V1.0; SheetNumber: 4; SheetTotal: 4
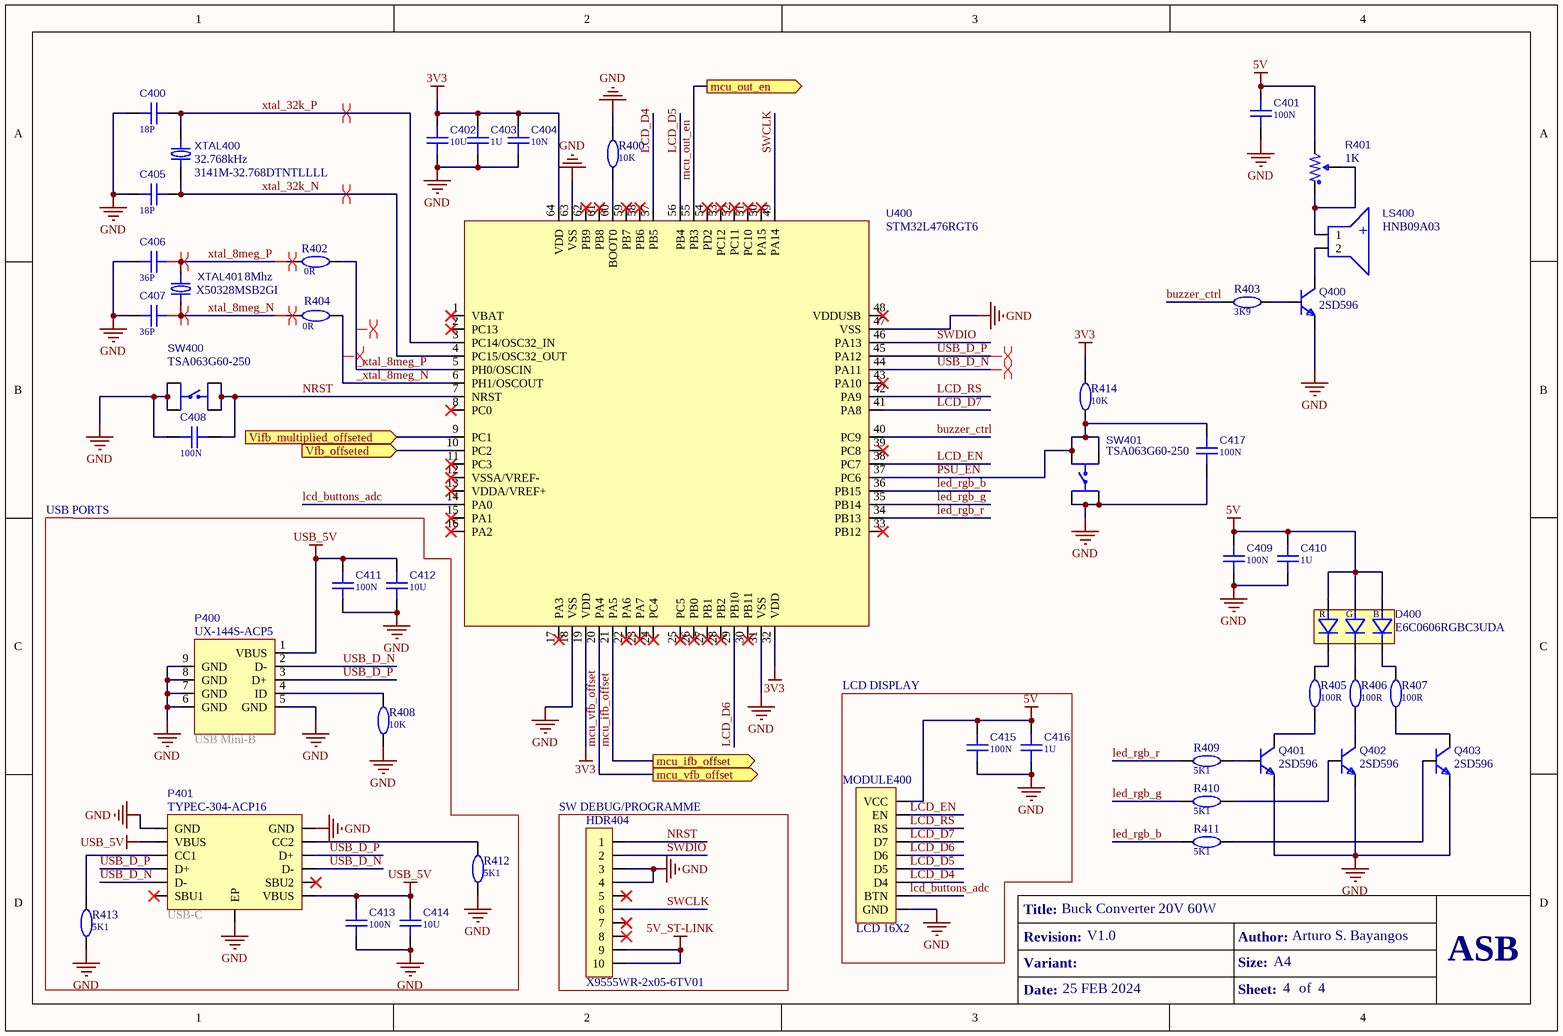
[diagram p3: MCU_buck.SchDoc]

### Parts
C400  value 18P  [CAP_0603]  (hidden comment: CAPACITOR)
C401  value 100N  [CAP_0402]  (hidden comment: CAPACITOR)
C402  value 10U  [CAP_1210]  (hidden comment: CAPACITOR)
C403  value 1U  [CAP_0603]  (hidden comment: CAPACITOR)
C404  value 10N  [CAP_0402]  (hidden comment: CAPACITOR)
C405  value 18P  [CAP_0603]  (hidden comment: CAPACITOR)
C406  value 36P  [CAP_0402]  (hidden comment: CAPACITOR)
C407  value 36P  [CAP_0402]  (hidden comment: CAPACITOR)
C408  value 100N  [CAP_0402]  (hidden comment: CAPACITOR)
C409  value 100N  [CAP_0402]  (hidden comment: CAPACITOR)
C410  value 1U  [CAP_0603]  (hidden comment: CAPACITOR)
C411  value 100N  [CAP_0402]  (hidden comment: CAPACITOR)
C412  value 10U  [CAP_1210]  (hidden comment: CAPACITOR)
C413  value 100N  [CAP_0402]  (hidden comment: CAPACITOR)
C414  value 10U  [CAP_1210]  (hidden comment: CAPACITOR)
C415  value 100N  [CAP_0402]  (hidden comment: CAPACITOR)
C416  value 1U  [CAP_0603]  (hidden comment: CAPACITOR)
C417  value 100N  [CAP_0402]  (hidden comment: CAPACITOR)
D400  value E6C0606RGBC3UDA  [LED_0603]  (hidden comment: LED_RGB_COMMON_P)
HDR404  value X9555WR-2x05-6TV01  [SOCKET_2X5P_2.54mm_HORZ_X9555WR]  (hidden comment: HEADER_2X5P_2.54mm)
LS400  value HNB09A03  [BUZZER_HNB09A03]  (hidden comment: BUZZER)
MODULE400  value LCD 16X2  [LCD_MODULE_16X2]  (hidden comment: LCD_MODULE_16X2)
P400  value UX-144S-ACP5  [USB_Mini-B_UX-144S-ACP5]  (hidden comment: USB_Mini-B)
P401  value TYPEC-304-ACP16  [USB-C_2.0_12PIN]  (hidden comment: USB-C_2.0)
Q400  value 2SD596  [SOT-23]  (hidden comment: BJT_NPN)
Q401  value 2SD596  [SOT-23]  (hidden comment: BJT_NPN)
Q402  value 2SD596  [SOT-23]  (hidden comment: BJT_NPN)
Q403  value 2SD596  [SOT-23]  (hidden comment: BJT_NPN)
R400  value 10K  [RES_0603]  (hidden comment: RESISTOR)
R401  value 1K  [RES_GF063P1-B102]  (hidden comment: RESISTOR_POT)
R402  value 0R  [RES_0402]  (hidden comment: RESISTOR)
R403  value 3K9  [RES_0603]  (hidden comment: RESISTOR)
R404  value 0R  [RES_0402]  (hidden comment: RESISTOR)
R405  value 100R  [RES_0603]  (hidden comment: RESISTOR)
R406  value 100R  [RES_0603]  (hidden comment: RESISTOR)
R407  value 100R  [RES_0603]  (hidden comment: RESISTOR)
R408  value 10K  [RES_0603]  (hidden comment: RESISTOR)
R409  value 5K1  [RES_0402]  (hidden comment: RESISTOR)
R410  value 5K1  [RES_0402]  (hidden comment: RESISTOR)
R411  value 5K1  [RES_0402]  (hidden comment: RESISTOR)
R412  value 5K1  [RES_0402]  (hidden comment: RESISTOR)
R413  value 5K1  [RES_0402]  (hidden comment: RESISTOR)
R414  value 10K  [RES_0603]  (hidden comment: RESISTOR)
SW400  value TSA063G60-250  [SMD_TSA063G60-250]  (hidden comment: SWITCH_SPST)
SW401  value TSA063G60-250  [SMD_TSA063G60-250]  (hidden comment: SWITCH_SPST)
U400  value STM32L476RGT6  [LQFP-64]  (hidden comment: MCU_STM32L476RGT6)
XTAL400  value 3141M-32.768DTNTLLLL  Frequency: 32.768kHz  [SMD_W1.5mm_L4.1mm_3141M-32.768DTNTLLLL]  (hidden comment: XTAL)
XTAL401  value X50328MSB2GI  Frequency: 8Mhz  [SMD_W3.2mm_L5.0m_X50328MSB2GI]  (hidden comment: XTAL)

### Blocks framed on the sheet
LCD DISPLAY: C415 C416 MODULE400
SW DEBUG/PROGRAMME: HDR404

### Ports
mcu_ifb_offset (out), mcu_out_en (out), mcu_vfb_offset (out), Vfb_offseted (in), Vifb_multiplied_offseted (in)

### Nets
3V3: C402.2 C403.2 C404.2 R414.2 U400.19(VDD) U400.32(VDD) U400.64(VDD)
5V: C401.2 C409.2 C410.2 C415.2 C416.2 D400.2(P) MODULE400.5(VCC) R401.3
5V_ST-LINK: HDR404.9 HDR404.10
GND: C400.1 C401.1 C402.1 C403.1 C404.1 C405.1 C406.1 C407.1 C408.1 C409.1 C410.1 C411.1 C412.1 C413.1 C414.1 C415.1 C416.1 C417.2 HDR404.3 HDR404.4 MODULE400.6(GND) P400.5(GND) P400.6(GND) P400.7(GND) P400.8(GND) P400.9(GND) P401.A1B12(GND) P401.B1A12(GND) P401.EP Q400.2(E) Q401.2(E) Q402.2(E) Q403.2(E) R400.2 R408.1 R412.2 R413.2 SW400.3 SW400.4 SW401.3 SW401.4 U400.18(VSS) U400.31(VSS) U400.47(VSS) U400.63(VSS)
USB_5V: C411.2 C412.2 C413.2 C414.2 P400.1(VBUS) P401.A4B9(VBUS) P401.B4A9(VBUS)
_xtal_8meg_N: R404.2 U400.6(PH1/OSCOUT)
_xtal_8meg_P: R402.2 U400.5(PH0/OSCIN)
buzzer_ctrl: R403.1 U400.40(PC9)
lcd_buttons_adc: MODULE400.7(BTN) U400.14(PA0)
LCD_D4: MODULE400.17(D4) U400.57(PB5)
LCD_D5: MODULE400.18(D5) U400.56(PB4)
LCD_D6: MODULE400.19(D6) U400.29(PB10)
LCD_D7: MODULE400.20(D7) U400.41(PA8)
LCD_EN: MODULE400.22(EN) U400.38(PC7)
LCD_RS: MODULE400.21(RS) U400.42(PA9)
led_rgb_b: R411.1 U400.36(PB15)
led_rgb_g: R410.1 U400.35(PB14)
led_rgb_r: R409.1 U400.34(PB13)
mcu_ifb_offset: U400.21(PA5) ; port mcu_ifb_offset
mcu_out_en: U400.55(PB3) ; port mcu_out_en
mcu_vfb_offset: U400.20(PA4) ; port mcu_vfb_offset
NRST: C408.2 HDR404.1 SW400.1 SW400.2 U400.7(NRST)
PSU_EN: C417.1 R414.1 SW401.1 SW401.2 U400.37(PC6)
SWCLK: HDR404.6 U400.49(PA14)
SWDIO: HDR404.2 U400.46(PA13)
USB_D_N: P400.2(D-) P401.A7(D-) P401.B7(D-) U400.44(PA11)
USB_D_P: P400.3(D+) P401.A6(D+) P401.B6(D+) U400.45(PA12)
Vfb_offseted: U400.10(PC2) ; port Vfb_offseted
Vifb_multiplied_offseted: U400.9(PC1) ; port Vifb_multiplied_offseted
xtal_8meg_N: C407.2 R404.1 XTAL401.1
xtal_8meg_P: C406.2 R402.1 XTAL401.2
xtal_32k_N: C405.2 U400.4(PC15/OSC32_OUT) XTAL400.2
xtal_32k_P: C400.2 U400.3(PC14/OSC32_IN) XTAL400.1
NetD400_1: D400.1(B) R407.2
NetD400_3: D400.3(G) R406.2
NetD400_4: D400.4(R) R405.2
NetLS400_1: LS400.1 R401.1 R401.2
NetLS400_2: LS400.2 Q400.3(C)
NetP400_4: P400.4(ID) R408.2
NetP401_A5: P401.A5(CC1) R413.1
NetP401_B5: P401.B5(CC2) R412.1
NetQ400_1: Q400.1(B) R403.2
NetQ401_1: Q401.1(B) R409.2
NetQ401_3: Q401.3(C) R405.1
NetQ402_1: Q402.1(B) R410.2
NetQ402_3: Q402.3(C) R406.1
NetQ403_1: Q403.1(B) R411.2
NetQ403_3: Q403.3(C) R407.1
NetR400_1: R400.1 U400.60(BOOT0)

Not connected (* = marked no-connect by the designer): HDR404 5* 7* 8*; P401 A8(SBU1)* B8(SBU2)*; U400 1(VBAT)* 2(PC13)* 8(PC0)* 11(PC3)* 12(VSSA/VREF-)* 13(VDDA/VREF+)* 15(PA1)* 16(PA2)* 17(PA3)* 22(PA6)* 23(PA7)* 24(PC4)* 25(PC5)* 26(PB0)* 27(PB1)* 28(PB2)* 30(PB11)* 33(PB12)* 39(PC8)* 43(PA10)* 48(VDDUSB)* 50(PA15)* 51(PC10)* 52(PC11)* 53(PC12)* 54(PD2)* 58(PB6)* 59(PB7)* 61(PB8)* 62(PB9)*

### Layout directives
differential pair: (no net found under the mark), _xtal_8meg_N, _xtal_8meg_P, USB_D_N, USB_D_P, xtal_8meg_N, xtal_8meg_P, xtal_32k_N, xtal_32k_P

### Notes on the sheet
- USB PORTS
- (near P400) USB Mini-B
- (near P401) USB-C
- Title:
- Revision:
- Variant:
- Size:
- Author:
- A4
- ASB
- Date:
- Sheet:
- of
- (in symbol HNB09A03) +

### Library data of the parts
C400 C405 = CC0603JRNPO9BN180: as C305 on sheet Feedback_Controller_Buck; Part Number: CC0603JRNPO9BN180; ComponentLink1Description: Datasheet; ComponentLink1URL: https://datasheet.lcsc.com/lcsc/2304140030_YAGEO-CC0603JRNPO9BN180_C107040.pdf; ComponentLink2Description: Characteristics; Package: 0603
C401 C408 C409 C411 C413 C415 C417 = UMK105B7104KV-FR: as C100 on sheet Top_View; Part Number: UMK105B7104KV-FR; ComponentLink1Description: Datasheet; ComponentLink1URL: https://datasheet.lcsc.com/lcsc/2211282030_Taiyo-Yuden-UMK105B7104KV-FR_C2167491.pdf; ComponentLink2Description: Characteristics; ComponentLink2URL: Datasheets\Capacitors\UMK105B7104KV-FR_TaiyoYuden.pdf; Package: 0402
C402 C412 C414 = UMK325AB7106KM-T: as C102 on sheet Top_View; Part Number: UMK325AB7106KM-T; ComponentLink1Description: Datasheet; ComponentLink1URL: https://datasheet.lcsc.com/lcsc/2211282230_Taiyo-Yuden-UMK325AB7106KM-T_C386167.pdf; ComponentLink2Description: Characteristics; ComponentLink2URL: Datasheets\Capacitors\UMK325AB7106KM-T_TaiyoYuden_Char.pdf; Package: 1210
C403 C410 C416 = TMK107AB7105KAHT: as C109 on sheet Top_View; Part Number: TMK107AB7105KAHT; ComponentLink1Description: Datasheet; ComponentLink1URL: https://datasheet.lcsc.com/lcsc/1912111437_Taiyo-Yuden-TMK107AB7105KAHT_C386079.pdf; ComponentLink2Description: Characteristics; ComponentLink2URL: Datasheets\Capacitors\TMK107AB7105KAHT_TaiyoYuden.pdf; Package: 0603
C404 = UMF105B7103KVHF: as C221 on sheet Main_Buck; Part Number: UMF105B7103KVHF; ComponentLink1Description: Datasheet; ComponentLink1URL: https://datasheet.lcsc.com/lcsc/1912111437_Taiyo-Yuden-UMF105B7103KVHF_C386105.pdf; ComponentLink2Description: Characteristics; ComponentLink2URL: Datasheets\Capacitors\UMF105B7103KVHF_TaiyoYuden.pdf; Package: 0402
C406 C407 = CC0603JRNPO9BN360: CAP 36P 0402 NPO 50V 5%; Manifacturer: YAGEO; Part Number: CC0603JRNPO9BN360; ComponentLink1Description: Datasheet; ComponentLink1URL: https://datasheet.lcsc.com/lcsc/2304140030_YAGEO-CC0603JRNPO9BN360_C134070.pdf; Package: 402
D400 = E6C0606RGBC3UDA: LED E6C0606RGBC3UDA 0603 RGB 5V 20mA; Forward voltage: 2.20V (max, red), 3.40V (max , green), 3.40V (max, blue); Manifacturer: EKINGLUX; Part Number: E6C0606RGBC3UDA; Package: 0603; Type: RGB; Current: 20mA; Voltage: 5V; Operating temperature: 90 ℃; ComponentLink1Description: Datasheet; ComponentLink1URL: https://datasheet.lcsc.com/lcsc/2203301730_EKINGLUX-E6C0606RGBC3UDA_C375569.pdf
HDR404 = X9555WR-2x05-6TV01: SOCKET / X9555WR-2x05-6TV01 TH 2.54mm 2X5P HORZ; Current: 3A; Manifacturer: XKB Connectivity; Part Number: X9555WR-2x05-6TV01; Package: TH; Pitch: 2.54mm; Voltage: N/A; Structure: 2X5P HORZ; Supported protocol: N/A; ComponentLink1Description: Datasheet; ComponentLink1URL: https://datasheet.lcsc.com/lcsc/2110112030_XKB-Connectivity-X9555WR-2x05-6TV01_C2682217.pdf
LS400 = HNB09A03: BUZZER HNB09A03 TH 1.5V-5V 3Khz; Current: 30mA; Supply Voltage: 1.5V - 4.5V; Tj: 20℃~+70℃; Manifacturer: Jiangsu Huaneng Elec; Part Number: HNB09A03; Package: TH; ComponentLink1Description: Datasheet; ComponentLink1URL: https://datasheet.lcsc.com/lcsc/1811141116_Jiangsu-Huaneng-Elec-HNB09A03_C96102.pdf; ComponentLink2Description: Characteristics
MODULE400 = LCD_16X2_Arduino_Shield: LCD Display 16X2 Arduino Shield; Part Number: LCD_16X2_Arduino_Shield; ComponentLink1Description: Datasheet; ComponentLink1URL: NA
P400 = UX-144S-ACP5: CONN UX-144S-ACP5 SMD USB_Mini-B 2.0; Current: 1.5A; Structure: USB Mini-B; Supported protocol: USB 2.0; Manifacturer: XUNPU; Part Number: UX-144S-ACP5; Package: SMD; Pitch: N/A; Voltage: N/A; ComponentLink1Description: Datasheet; ComponentLink1URL: https://datasheet.lcsc.com/lcsc/2008122036_XUNPU-UX-144S-ACP5_C720611.pdf
P401 = TYPEC-304-ACP16: CONN TYPEC-304-ACP16 SMD USB-C 2.0; Current: 3A; Supported protocol: USB 2.0; Manifacturer: XUNPU; Part Number: TYPEC-304-ACP16; Package: SMD; Pitch: N/A; Voltage: N/A; Structure: USB-C; ComponentLink1Description: Datasheet; ComponentLink1URL: https://datasheet.lcsc.com/lcsc/2203111830_XUNPU-TYPEC-304-ACP16_C2982555.pdf
Q400-Q403 = 2SD596: as Q301 on sheet Feedback_Controller_Buck; ComponentLink1Description: Datasheet; ComponentLink1URL: https://datasheet.lcsc.com/lcsc/2109011130_YONGYUTAI-2SD596_C2891824.pdf; Part Number: 2SD596; Package: SOT-23; VCEO: 25V; Power: 0.2W
R400 R408 R414 = ARG03BTC1002: as R101 on sheet Top_View; Part Number: ARG03BTC1002; ComponentLink1Description: Datasheet; ComponentLink1URL: Datasheets\Resistors\ARG03BTC1002_VikingTech.pdf; ComponentLink2Description: Characteristics; Package: 0603
R401 = GF063P1-B102: as R320 on sheet Feedback_Controller_Buck; ComponentLink1Description: Datasheet; ComponentLink1URL: https://datasheet.lcsc.com/lcsc/2304140030_Tokyo-Cosmos-Elec-GF063P1-B102_C128078.pdf; ComponentLink2Description: Characteristics; Part Number: GF063P1-B102; Package: TH
R402 R404 = 0402WGF0000TCE: as R313 on sheet Feedback_Controller_Buck; Part Number: 0402WGF0000TCE; ComponentLink1Description: Datasheet; ComponentLink1URL: https://datasheet.lcsc.com/lcsc/2206010216_UNI-ROYAL-Uniroyal-Elec-0402WGF0000TCE_C17168.pdf; Package: 402
R403 = RC0603FR-073K9L: RES 3K9 0603 1% 0.1W 75V; Manifacturer: YAGEO; Part Number: RC0603FR-073K9L; ComponentLink1Description: Datasheet; ComponentLink1URL: https://datasheet.lcsc.com/lcsc/2304140030_YAGEO-RC0603FR-073K9L_C114616.pdf; ComponentLink2Description: Characteristics; Package: 0603
R405-R407 = RT0603CRE07100RL: as R204 on sheet Main_Buck; Part Number: RT0603CRE07100RL; ComponentLink1Description: Datasheet; ComponentLink1URL: Datasheets\Resistors\RT0603CRE07100RL_Yageo.pdf; ComponentLink2Description: Characteristics; Package: 0604
R409-R413 = RC0402FR-075K1L: RES 5K1 0402 1% 0.625W 50V; Manifacturer: YAGEO; Part Number: RC0402FR-075K1L; ComponentLink1Description: Datasheet; ComponentLink1URL: https://datasheet.lcsc.com/lcsc/2304140030_YAGEO-RC0402FR-075K1L_C105872.pdf; Package: 402
SW400 SW401 = TSA063G60-250: SW / TSA063G60-250 SMD SPST 50mA 12V; Manifacturer: BRIGHT; Part Number: TSA063G60-250; Package: SMD; Type: SPST; Current: 50mA; Voltage: 12V; Operating temperature: -25℃~+70℃; ComponentLink1Description: Datasheet; ComponentLink1URL: https://datasheet.lcsc.com/lcsc/2304140030_BRIGHT-TSA063G60-250_C294566.pdf
U400 = STM32L476RGT6: IC STM32L476RGT6 LQFP-64 MCU; Supply Voltage: 1.71V - 3.6V; Tj: 85 ℃; Manifacturer: STMicroelectronics; Part Number: STM32L476RGT6; Package: LQFP-64; Type: MCU; ComponentLink1Description: Datasheet; ComponentLink1URL: https://datasheet.lcsc.com/lcsc/2304140030_STMicroelectronics-STM32L476RGT6_C74797.pdf; ComponentLink2Description: Characteristics
XTAL400 = 3141M-32.768DTNTLLLL: XTAL 3141M-32.768DTNTLLLL SMD_W1.5mm_L4.1mm 32.768kHz 12.5pF; Drive level: 0.2uW (typ), 1uW(max); ESR: <60kΩ; Frequency tolerance: ±20ppm / ±30ppm / ±50ppm; Co(shunt capacitance): 1.5pF (typ); C1(motional capacitance): 3.3fF(typ); Manifacturer: HCI; Part Number: 3141M-32.768DTNTLLLL; Package: SMD_W1.5mm_L4.1mm; Load Capacitance: 12.5pF; Operating temperature: –40 to +85°C; ComponentLink1Description: Datasheet; ComponentLink1URL: https://datasheet.lcsc.com/lcsc/2311151637_HCI-3141M-32-768DTNTLLLL_C7503638.pdf
XTAL401 = X50328MSB2GI: XTAL / X50328MSB2GI SMD_W3.2mm_L5.0mm 8Mhz 20pF; Drive level: 100uW(typ); ESR: 80Ω; Frequency tolerance: ±30ppm; Co(shunt capacitance): 3pF; Manifacturer: YXC; Part Number: X50328MSB2GI; Package: SMD_W3.2mm_L5.0m; Load Capacitance: 20pF; C1(motional capacitance): N/A; Operating temperature: –40 to +125°C; ComponentLink1Description: Datasheet; ComponentLink1URL: https://datasheet.lcsc.com/lcsc/2302201101_YXC-X50328MSB2GI_C115962.pdf

## Nets that join several sheets
3V3: Top_View (C111.2 C112.2 C113.2 U101.5), MCU_buck (7 pins)
5V: Top_View (8 pins), Feedback_Controller_Buck (C308.2 C318.2 U301.5 U303.5), MCU_buck (8 pins)
5V_ST-LINK: Top_View (D102.2), MCU_buck (HDR404.9 HDR404.10)
12V: Top_View (C115.2 C116.1 U102.1), Feedback_Controller_Buck (7 pins)
24V: Top_View (6 pins), Main_Buck (10 pins)
GND: Top_View (21 pins), Main_Buck (21 pins), Feedback_Controller_Buck (24 pins), MCU_buck (45 pins)
LOAD_P: Main_Buck (12 pins), Feedback_Controller_Buck (R302.2)
USB_5V: Top_View (D101.2), MCU_buck (7 pins)
mcu_ifb_offset: Feedback_Controller_Buck (R311.1 R314.1), MCU_buck (U400.21)
mcu_out_en: Feedback_Controller_Buck (Q302.1), MCU_buck (U400.55)
mcu_vfb_offset: Feedback_Controller_Buck (R303.2), MCU_buck (U400.20)
PWM_H: Main_Buck (R200.1), Feedback_Controller_Buck (U302.3)
PWM_L: Main_Buck (R202.1), Feedback_Controller_Buck (U302.8)
shunt_fil_N: Main_Buck (C235.1 R206.2), Feedback_Controller_Buck (R318.1)
shunt_fil_P: Main_Buck (C235.2 R204.2), Feedback_Controller_Buck (R316.1)
switch_node: Main_Buck (L200.1 Q200.3 Q201.4 R201.1), Feedback_Controller_Buck (C315.1 C316.2 U302.4)
Vfb_offseted: Feedback_Controller_Buck (R305.1 R308.1 R310.2 U301.1), MCU_buck (U400.10)
Vifb_multiplied_offseted: Feedback_Controller_Buck (R320.1 R322.2 U303.1), MCU_buck (U400.9)

## Assembly variants
DNP: not fitted R314